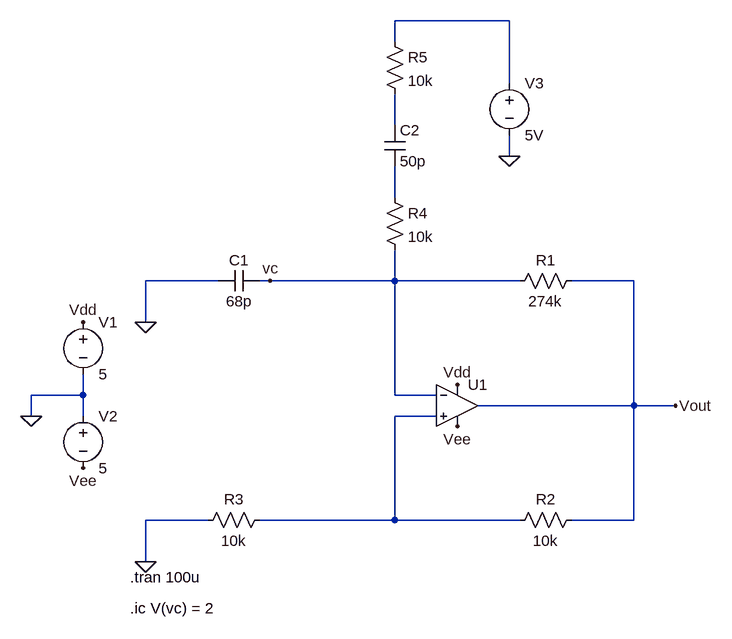
[diagram p0: schematic Oscillator_positive_feedback_Ideal_opamp.asc]
Oscillator_positive_feedback_Ideal_opamp.asc, the LTspice schematic file:
Version 4
SHEET 1 1232 1264
WIRE 496 -304 320 -304
WIRE 320 -272 320 -304
WIRE 496 -208 496 -304
WIRE 320 -144 320 -192
WIRE 496 -96 496 -128
WIRE 320 -32 320 -80
WIRE 48 96 -64 96
WIRE 128 96 112 96
WIRE 320 96 320 48
WIRE 320 96 128 96
WIRE 512 96 320 96
WIRE 688 96 592 96
WIRE -64 160 -64 96
WIRE -160 272 -160 240
WIRE -160 272 -240 272
WIRE 320 272 320 96
WIRE 384 272 320 272
WIRE 416 272 416 256
WIRE 688 288 688 96
WIRE 688 288 448 288
WIRE 752 288 688 288
WIRE -240 304 -240 272
WIRE -160 304 -160 272
WIRE 384 304 320 304
WIRE 416 320 416 304
WIRE 32 464 -64 464
WIRE 320 464 320 304
WIRE 320 464 112 464
WIRE 512 464 320 464
WIRE 688 464 688 288
WIRE 688 464 592 464
WIRE -64 528 -64 464
FLAG -64 160 0
FLAG -64 528 0
FLAG 752 288 Vout
FLAG 128 96 vc
FLAG -160 160 Vdd
FLAG 416 256 Vdd
FLAG -160 384 Vee
FLAG 416 320 Vee
FLAG -240 304 0
FLAG 496 -96 0
SYMBOL res 608 80 R90
WINDOW 0 0 56 VBottom 2
WINDOW 3 32 56 VTop 2
SYMATTR InstName R1
SYMATTR Value 274k
SYMBOL res 608 448 R90
WINDOW 0 0 56 VBottom 2
WINDOW 3 32 56 VTop 2
SYMATTR InstName R2
SYMATTR Value 10k
SYMBOL res 128 448 R90
WINDOW 0 0 56 VBottom 2
WINDOW 3 32 56 VTop 2
SYMATTR InstName R3
SYMATTR Value 10k
SYMBOL cap 112 80 R90
WINDOW 0 0 32 VBottom 2
WINDOW 3 32 32 VTop 2
SYMATTR InstName C1
SYMATTR Value 68p
SYMBOL voltage -160 144 R0
SYMATTR InstName V1
SYMATTR Value 5
SYMBOL voltage -160 288 R0
WINDOW 123 0 0 Left 2
WINDOW 39 0 0 Left 2
SYMATTR InstName V2
SYMATTR Value 5
SYMBOL res 304 -48 R0
SYMATTR InstName R4
SYMATTR Value 10k
SYMBOL res 304 -288 R0
SYMATTR InstName R5
SYMATTR Value 10k
SYMBOL cap 304 -144 R0
SYMATTR InstName C2
SYMATTR Value 50p
SYMBOL voltage 496 -224 R0
SYMATTR InstName V3
SYMATTR Value 5V
SYMBOL Opamps\\UniversalOpamp2 416 288 R0
SYMATTR InstName U1
SYMATTR Value2 Avol=100 GBW=10Meg Slew=10Meg
TEXT -88 552 Left 2 !.tran 100u
TEXT -88 600 Left 2 !.ic V(vc) = 2

The netlist it stands for:
* Oscillator_positive_feedback_Ideal_opamp.asc
R1 Vout vc 274k
R2 Vout N004 10k
R3 N004 0 10k
C1 vc 0 68p
V1 Vdd 0 5
V2 0 Vee 5
R4 N003 vc 10k
R5 N001 N002 10k
C2 N002 N003 50p
V3 N001 0 5V
XU1 N004 vc Vdd Vee Vout level.2 Avol=100 GBW=10Meg Slew=10Meg ilimit=25m rail=0 Vos=0 phimargin=45 en=0 enk=0 in=0 ink=0 Rin=500Meg  ; pins IN+ IN- V+ V- OUT
.tran 100u
.ic V(vc) = 2
.lib UniversalOpamps2.sub
.backanno
.end